# EAGLE design Keg Cop - Devel SMD (EAGLE 9.6.2)
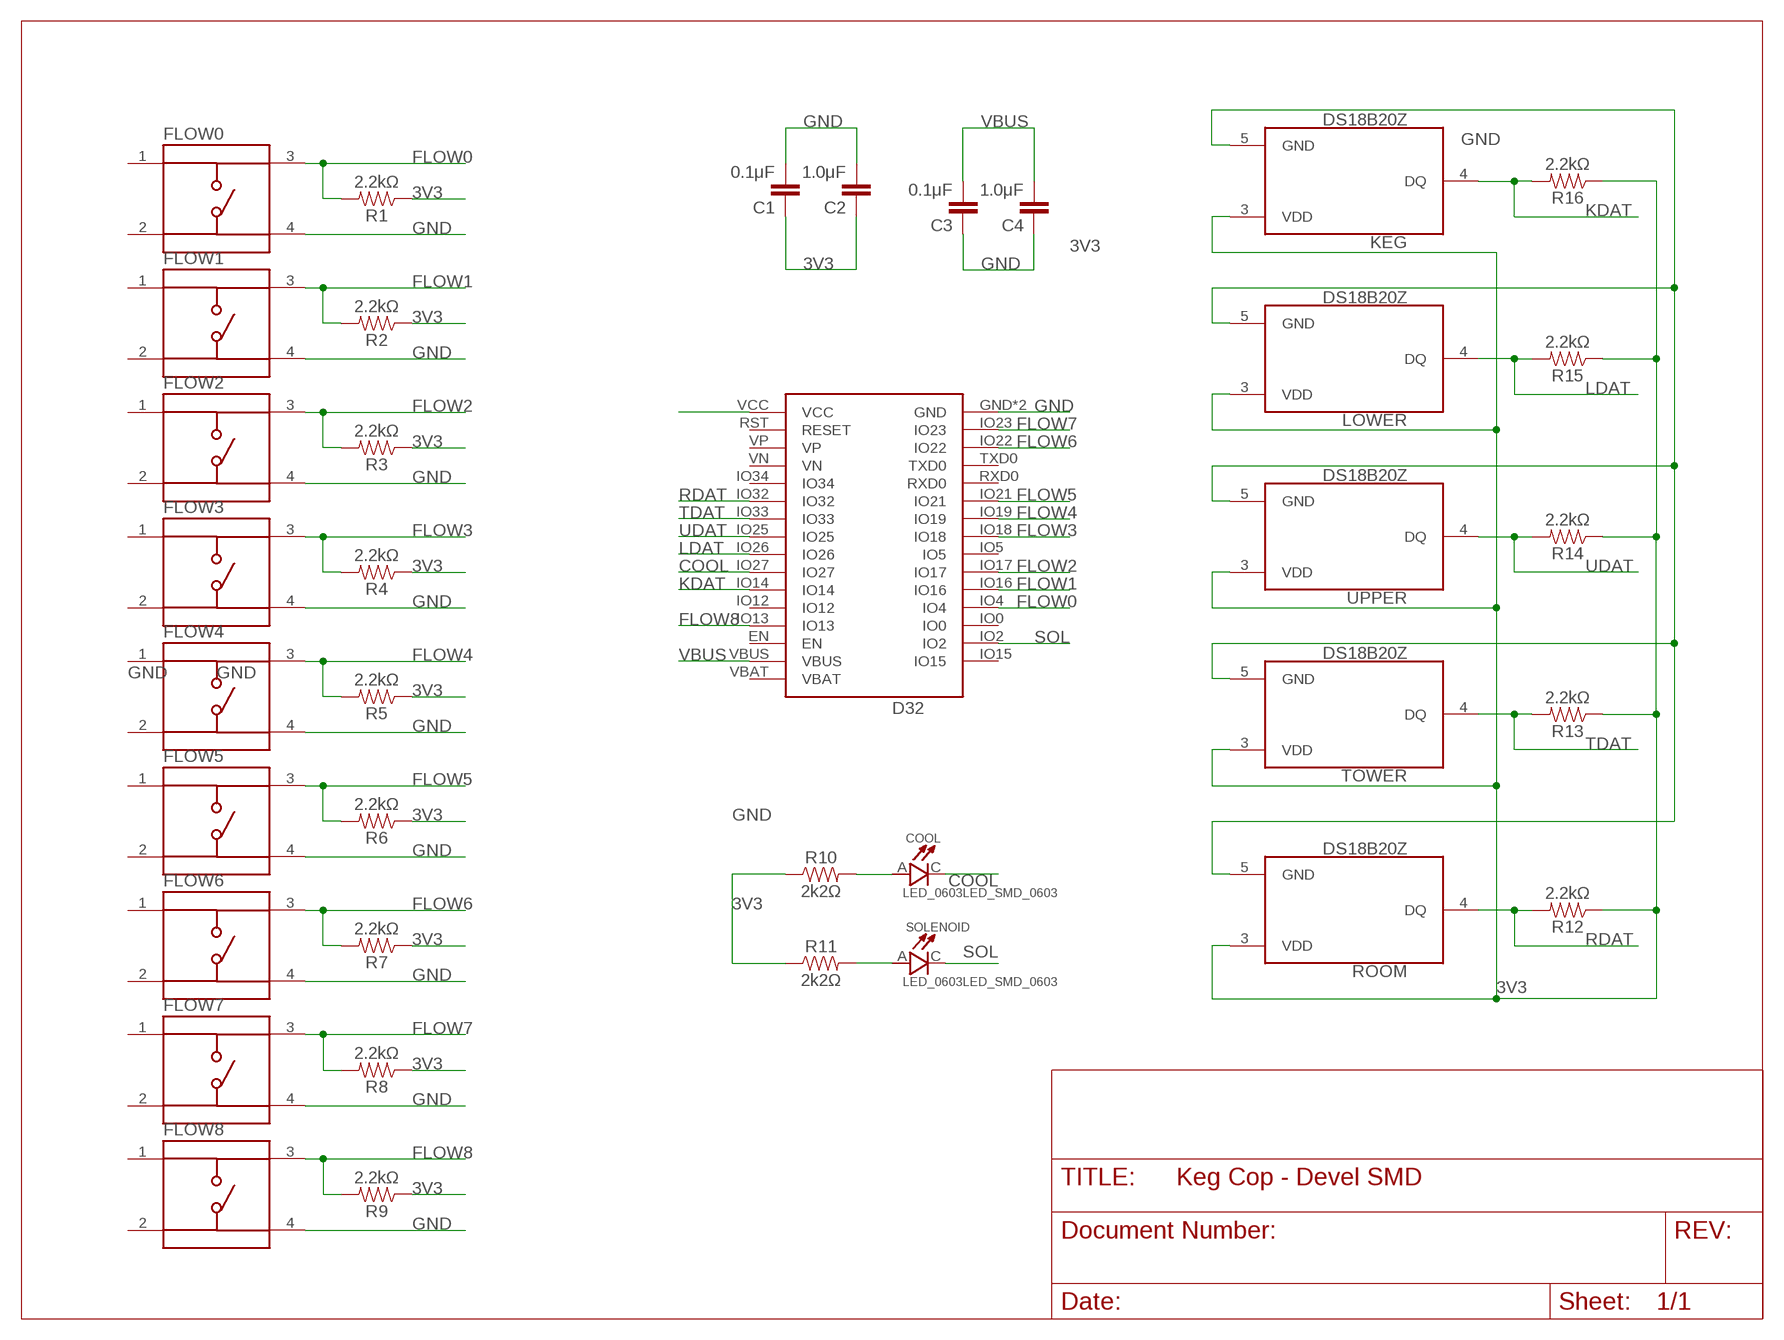
[diagram p0: schematic, sheet 1]

## Parts
C1  0.1μF  CAP_SMD0805  [SMD-0805]
C2  1.0μF  CAP_SMD0805  [SMD-0805]
C3  0.1μF  CAP_SMD0805  [SMD-0805]
C4  1.0μF  CAP_SMD0805  [SMD-0805]
COOL  LED_0603LED_SMD_0603  [LED_SMD_0603]
D32  Lolin D32  WEMOS-D32D32_NO_BATT  [D32_NO_BATT]
FLOW0  TS08-66-43-BK-160-SMT-67  [SW_TS08-66-43-BK-160-SMT-67]
FLOW1  TS08-66-43-BK-160-SMT-67  [SW_TS08-66-43-BK-160-SMT-67]
FLOW2  TS08-66-43-BK-160-SMT-67  [SW_TS08-66-43-BK-160-SMT-67]
FLOW3  TS08-66-43-BK-160-SMT-67  [SW_TS08-66-43-BK-160-SMT-67]
FLOW4  TS08-66-43-BK-160-SMT-67  [SW_TS08-66-43-BK-160-SMT-67]
FLOW5  TS08-66-43-BK-160-SMT-67  [SW_TS08-66-43-BK-160-SMT-67]
FLOW6  TS08-66-43-BK-160-SMT-67  [SW_TS08-66-43-BK-160-SMT-67]
FLOW7  TS08-66-43-BK-160-SMT-67  [SW_TS08-66-43-BK-160-SMT-67]
FLOW8  TS08-66-43-BK-160-SMT-67  [SW_TS08-66-43-BK-160-SMT-67]
KEG  DS18B20Z  [SOIC127P600X175-8N]
LOWER  DS18B20Z  [SOIC127P600X175-8N]
R1  2.2kΩ  RES_SMD0805  [SMD-0805]
R2  2.2kΩ  RES_SMD0805  [SMD-0805]
R3  2.2kΩ  RES_SMD0805  [SMD-0805]
R4  2.2kΩ  RES_SMD0805  [SMD-0805]
R5  2.2kΩ  RES_SMD0805  [SMD-0805]
R6  2.2kΩ  RES_SMD0805  [SMD-0805]
R7  2.2kΩ  RES_SMD0805  [SMD-0805]
R8  2.2kΩ  RES_SMD0805  [SMD-0805]
R9  2.2kΩ  RES_SMD0805  [SMD-0805]
R10  2k2Ω  RES_SMD0805  [SMD-0805]
R11  2k2Ω  RES_SMD0805  [SMD-0805]
R12  2.2kΩ  RES_SMD0805  [SMD-0805]
R13  2.2kΩ  RES_SMD0805  [SMD-0805]
R14  2.2kΩ  RES_SMD0805  [SMD-0805]
R15  2.2kΩ  RES_SMD0805  [SMD-0805]
R16  2.2kΩ  RES_SMD0805  [SMD-0805]
ROOM  DS18B20Z  [SOIC127P600X175-8N]
SOLENOID  LED_0603LED_SMD_0603  [LED_SMD_0603]
TOWER  DS18B20Z  [SOIC127P600X175-8N]
UPPER  DS18B20Z  [SOIC127P600X175-8N]

## Nets
3V3 [3v]: C1.1 C2.1 D32.VCC KEG.3(VDD) LOWER.3(VDD) R1.1 R2.1 R3.1 R4.1 R5.1 R6.1 R7.1 R8.1 R9.1 R10.1 R11.1 R12.1 R13.1 R14.1 R15.1 R16.1 ROOM.3(VDD) TOWER.3(VDD) UPPER.3(VDD)
COOL: COOL.C D32.IO27
FLOW0: D32.IO4 FLOW0.3 R1.2
FLOW1: D32.IO16 FLOW1.3 R2.2
FLOW2: D32.IO17 FLOW2.3 R3.2
FLOW3: D32.IO18 FLOW3.3 R4.2
FLOW4: D32.IO19 FLOW4.3 R5.2
FLOW5: D32.IO21 FLOW5.3 R6.2
FLOW6: D32.IO22 FLOW6.3 R7.2
FLOW7: D32.IO23 FLOW7.3 R8.2
FLOW8: D32.IO13 FLOW8.3 R9.2
GND: C1.2 C2.2 C3.1 C4.1 D32.GND D32.GND2(GND) FLOW0.4 FLOW1.4 FLOW2.4 FLOW3.4 FLOW4.4 FLOW5.4 FLOW6.4 FLOW7.4 FLOW8.4 KEG.5(GND) LOWER.5(GND) ROOM.5(GND) TOWER.5(GND) UPPER.5(GND)
KDAT: D32.IO14 KEG.4(DQ) R16.2
LDAT: D32.IO26 LOWER.4(DQ) R15.2
N$1: COOL.A R10.2
N$2: R11.2 SOLENOID.A
RDAT: D32.IO32 R12.2 ROOM.4(DQ)
SOL: D32.IO2 SOLENOID.C
TDAT: D32.IO33 R13.2 TOWER.4(DQ)
UDAT: D32.IO25 R14.2 UPPER.4(DQ)
VBUS: C3.2 C4.2 D32.VBUS
Unconnected: D32.EN D32.IO0 D32.IO5 D32.IO12 D32.IO15 D32.IO34 D32.RST(RESET) D32.RXD0 D32.TXD0 D32.VBAT D32.VN D32.VP FLOW0.1 FLOW0.2 FLOW1.1 FLOW1.2 FLOW2.1 FLOW2.2 FLOW3.1 FLOW3.2 FLOW4.1 FLOW4.2 FLOW5.1 FLOW5.2 FLOW6.1 FLOW6.2 FLOW7.1 FLOW7.2 FLOW8.1 FLOW8.2

## Library data of the parts
C1-C4 = JBJLC:CAP_SMD
COOL SOLENOID = JBJLC:LED_0603: RED CHIP LED MINI-MOLD Check availability <https://pricing.snapeda.com/parts/SML-D12U1WT86/Rohm/view-part?ref=eda>; DESCRIPTION: Red 620nm LED Indication - Discrete 2.2V 0603 (1608 Metric); LCSC_PART: C2286; PACKAGE: 0603 Rohm
D32 = Donnie:WEMOS-D32: D32_REVERSE is a Reverse silkscreen for placing the Wemos D32 on the underside of the board D32_NO-KEEPOUT removes the keepout area beneath the antenna on the D32 and provides a note to avoid components and traces.; SPICEPREFIX: X
FLOW0 FLOW1-FLOW8 = JBJLC:TS08-66-43-BK-160-SMT-67: Check availability <https://pricing.snapeda.com/parts/TS08-66-43-BK-160-SMT-67/CUI%20Devices/view-part?ref=eda>; DESCRIPTION: 6 x 6 mm, 4.3 mm Actuator Height, 160 gf, Black, Surface Mount, IP67, SPST, Tactile Switch; LCSC_PART: C2888744; MF: BZCN; MP: TSD003B04326A03
KEG LOWER ROOM TOWER UPPER = JBJLC:DS18B20Z: DALLAS - DALLAS DS18B20Z High-Precision 1-Wire Digital Thermometer Check availability <https://pricing.snapeda.com/parts/DS18B20Z/Maxim%20Integrated/view-part?ref=eda>; AVAILABILITY: In Stock; DESCRIPTION: Temperature Sensor Digital, Local -55°C ~ 125°C 12 b 8-SOIC; LCSC_PART: C695837; MF: Maxim Integrated; MP: DS18B20Z; PACKAGE: SOIC-8 Maxim; PRICE: None; PURCHASE-URL: https://pricing.snapeda.com/search/part/DS18B20Z/?ref=eda
R1-R16 = JBJLC:RES_SMD

## Net classes
0 default: width 0.305 mm, clearance 0.305 mm
1 5v: width 0.406 mm, clearance 0.406 mm
2 3v: width 0.406 mm, clearance 0.406 mm

## Board
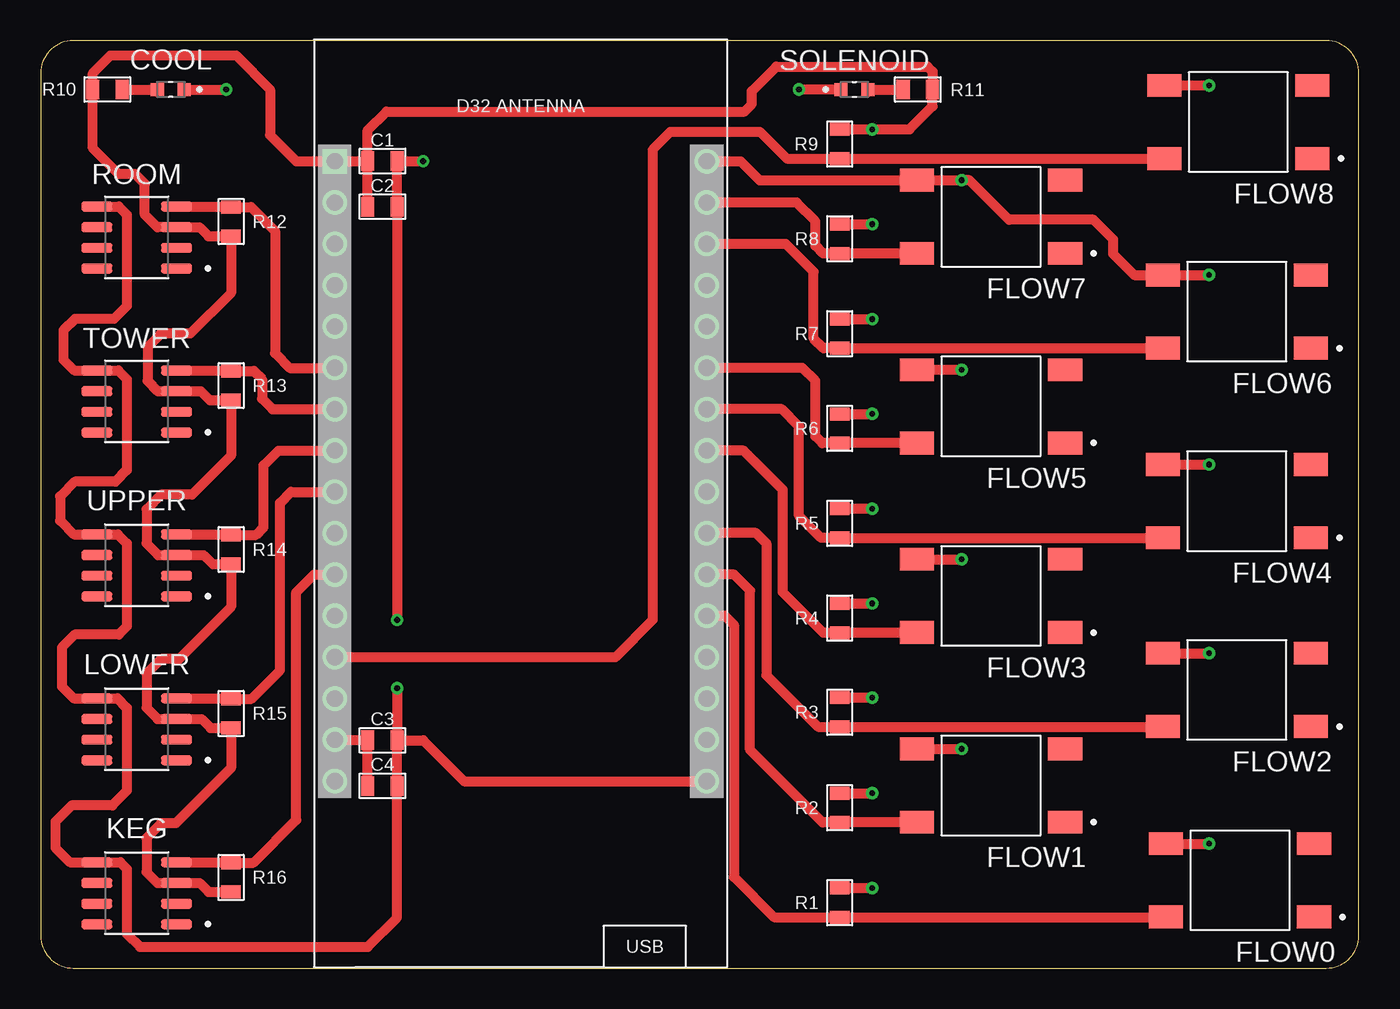
[diagram p1: board, top side]
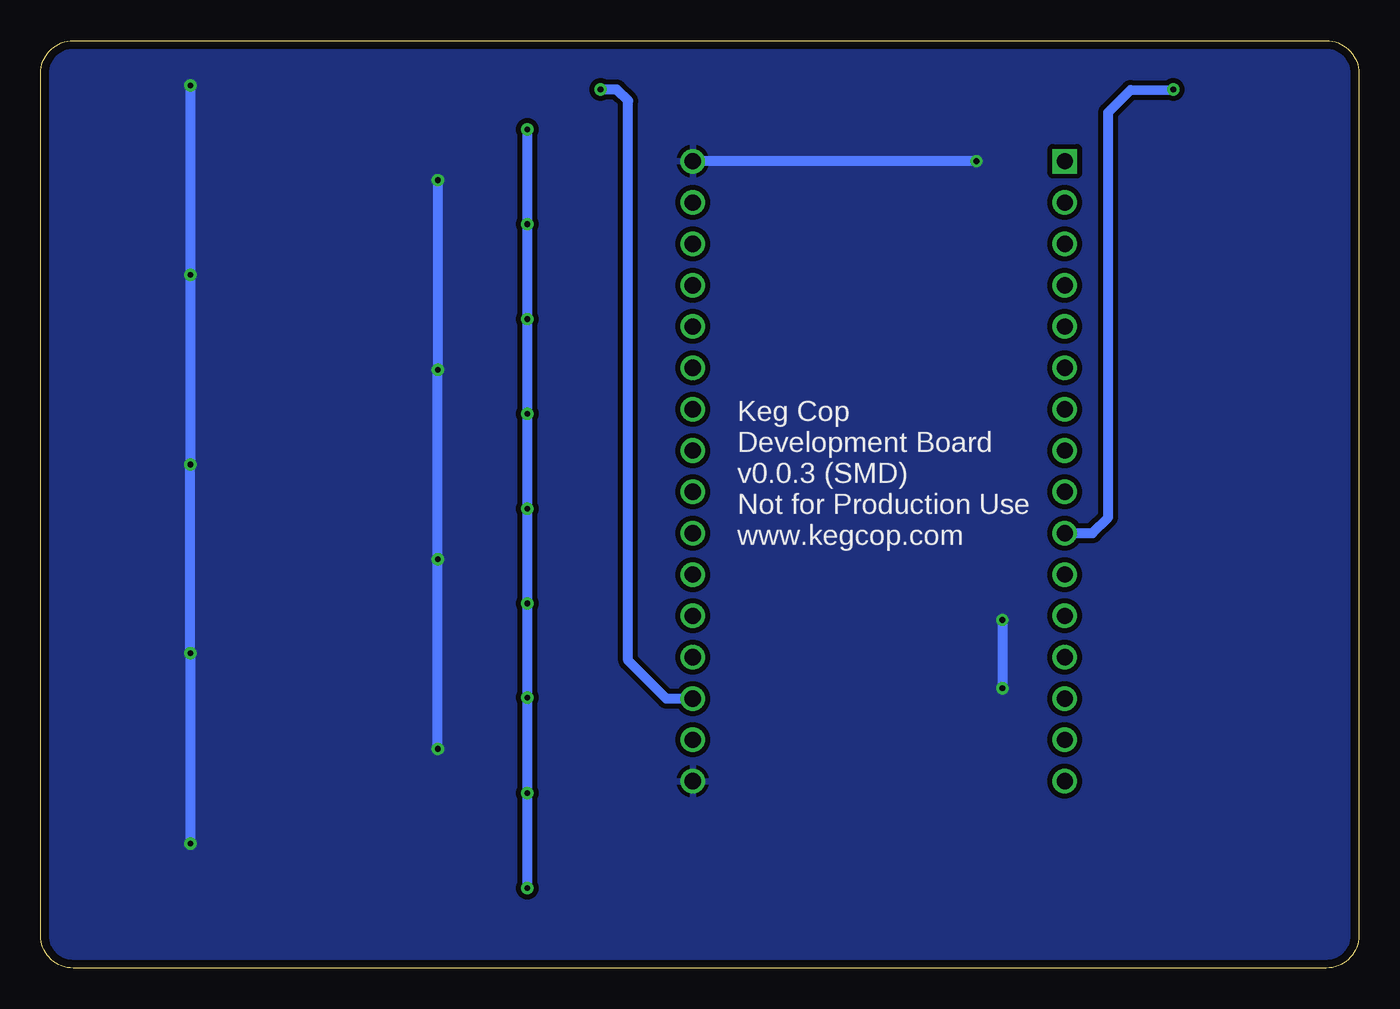
[diagram p2: board, bottom side, seen from below]

Size 81 x 57 mm. Coordinates in mm from the lower left corner, seen from the top.
Outline: 0,55 0,2 arc90 2,0 79,0 arc90 81,2 81,55 arc90 79,57 2,57 arc90 0,55
Copper layers (1*16): Top 0.035mm / dielectric 1.5mm / Bottom 0.035mm
Design rules "default *": minimum track width 6mil, minimum drill 0.35mm, track to track 6mil, track to pad 6mil, pad to pad 6mil, via to via 6mil, smd to smd 6mil, copper to edge 20mil, drill to drill 6mil, minimum pad ring 10mil, minimum via ring 8mil, stop-mask expansion 4mil, vias tented up to drill 20mil, thermal gap 10mil

### Footprints (pad centres in the part's own frame; a part is rotated, then mirrored left to right if it is on the bottom)
SMD-0805 = smd 0.8 x 1.2: 1 -0.9,0; 2 0.9,0
LED_SMD_0603 = smd 0.8 x 0.8: A 0.825,0; C -0.825,0
D32_NO_BATT = drill 1: EN -11.43,-12.7; GND 11.43,20.32; GND2 11.43,-17.78; IO0 11.43,-10.16; IO2 11.43,-12.7; IO4 11.43,-7.62; IO5 11.43,0; IO12 -11.43,-7.62; IO13 -11.43,-10.16; IO14 -11.43,-5.08; IO15 11.43,-15.24; IO16 11.43,-5.08; IO17 11.43,-2.54; IO18 11.43,2.54; IO19 11.43,5.08; IO21 11.43,7.62; IO22 11.43,15.24; IO23 11.43,17.78; IO25 -11.43,2.54; IO26 -11.43,0; IO27 -11.43,-2.54; IO32 -11.43,7.62; IO33 -11.43,5.08; IO34 -11.43,10.16; RST -11.43,17.78; RXD0 11.43,10.16; TXD0 11.43,12.7; VBAT -11.43,-17.78; VBUS -11.43,-15.24; VN -11.43,12.7; VP -11.43,15.24 | drill 1 square: VCC -11.43,20.32
SW_TS08-66-43-BK-160-SMT-67 = smd 2.1 x 1.4: 1 -4.55,2.25; 2 -4.55,-2.25; 3 4.55,2.25; 4 4.55,-2.25
SOIC127P600X175-8N = smd 1.9 x 0.6: 1 -2.455,1.905; 2 -2.455,0.635; 3 -2.455,-0.635; 4 -2.455,-1.905; 5 2.455,-1.905; 6 2.455,-0.635; 7 2.455,0.635; 8 2.455,1.905

### Placement (x,y rotation side)
C1  21,49.6 0 top
C2  21,46.8 0 top
C3  21,14 180 top
C4  21,11.2 180 top
COOL  8,54 180 top
D32  29.5,29.27 0 top
FLOW0  73.7,5.4 180 top
FLOW1  58.4,11.22 180 top
FLOW2  73.5,17.1 180 top
FLOW3  58.4,22.88 180 top
FLOW4  73.5,28.7 180 top
FLOW5  58.4,34.52 180 top
FLOW6  73.5,40.35 180 top
FLOW7  58.4,46.17 180 top
FLOW8  73.6,52 180 top
KEG  5.9,4.6 180 top
LOWER  5.9,14.68 180 top
R1  49.1,4.03 270 top
R2  49.1,9.85 270 top
R3  49.1,15.73 270 top
R4  49.1,21.51 270 top
R5  49.1,27.34 270 top
R6  49.1,33.17 270 top
R7  49.1,38.99 270 top
R8  49.1,44.82 270 top
R9  49.1,50.65 270 top
R10  4.1,54 0 top
R11  53.9,54 180 top
R12  11.7,45.88 90 top
R13  11.7,35.8 90 top
R14  11.7,25.73 90 top
R15  11.7,15.65 90 top
R16  11.7,5.58 90 top
ROOM  5.9,44.9 180 top
SOLENOID  50,54 0 top
TOWER  5.9,34.83 180 top
UPPER  5.9,24.75 180 top

### Tracks (layer width: path | path; a pad name or v marks a point on that pad's centre or on a via)
3V3  (via drill 0.35)
  Top 0.61: R16.1 10.32,4.68 9.77,5.24 KEG.3 7.17,5.24 6.5,5.9 6.5,8 7.4,8.9 8.3,8.9 11.7,12.3 R15.1 10.45,14.75 9.89,15.31 LOWER.3 7.19,15.31 6.5,16 6.5,18.1 7.4,19 8.5,19 11.7,22.2 R14.1 10.57,24.83 10.02,25.39 UPPER.3 7.21,25.39 6.5,26.1 6.5,28.2 7.4,29.1 9.3,29.1 11.7,31.5 R13.1 10.4,34.9 9.84,35.46 TOWER.3 7.2,35.46 6.56,36.1 6.56,38.16 7.4,39 9.2,39 11.7,41.5 R12.1 10.32,44.98 9.77,45.53 ROOM.3 7.17,45.53 6.4,46.3 6.4,48.2 5.8,48.8 4.8,48.8 3.2,50.4 R10.1 3.2,55 4.3,56.1 12,56.1 14.1,54 14.1,51.2 15.71,49.59 D32.VCC 20.09,49.59 | 20.09,49.59 C1.1 20.1,51.5 21.25,52.65 43.25,52.65 43.7,53.1 43.7,53.9 45.2,55.4 54.5,55.4 54.8,55.1 R11.1 54.8,52.96 53.39,51.55 v51.1,51.55 R9.1 | C2.1 20.1,49.58 20.09,49.59 | R3.1 v51.1,16.63 | R4.1 v51.1,22.41 | R5.1 v51.1,28.24 | R7.1 v51.1,39.89 | R2.1 v51.1,10.75 | R1.1 v51.1,4.92 | R8.1 v51.1,45.72 | R6.1 v51.1,34.07
  Bottom 0.61: v51.1,51.55 v51.1,45.72 v51.1,39.89 v51.1,34.07 v51.1,28.24 v51.1,22.41 v51.1,16.63 v51.1,10.75 v51.1,4.92
COOL  (via drill 0.35)
  Top 0.61: COOL.C v11.4,54
  Bottom 0.61: D32.IO27 16.37,26.73 15.4,27.7 15.4,52.6 14.04,53.96 v11.4,54
FLOW0
  Top 0.61: FLOW0.3 69.12,3.12 R1.2 45.08,3.12 42.6,5.6 42.6,21.1 42.05,21.65 D32.IO4
FLOW1
  Top 0.61: D32.IO16 42.61,24.19 43.6,23.2 43.6,13.4 48.05,8.95 R2.2 49.12,8.97 FLOW1.3
FLOW2
  Top 0.61: FLOW2.3 68.93,14.78 68.88,14.83 R3.2 47.77,14.83 44.6,18 44.6,26.1 43.97,26.73 D32.IO17
FLOW3
  Top 0.61: FLOW3.3 53.83,20.61 R4.2 48.09,20.61 45.6,23.1 45.6,29.4 43.19,31.81 D32.IO18
FLOW4
  Top 0.61: FLOW4.3 68.94,26.44 R5.2 47.96,26.44 46.6,27.8 46.6,33.3 45.55,34.35 D32.IO19
FLOW5
  Top 0.61: FLOW5.3 R6.2 48.03,32.27 47.6,32.7 47.6,36.1 46.81,36.89 D32.IO21
FLOW6
  Top 0.61: FLOW6.3 R7.2 48.11,38.09 47.5,38.7 47.5,42.8 45.79,44.51 D32.IO22
FLOW7
  Top 0.61: FLOW7.3 R8.2 48.08,43.92 47.6,44.4 47.6,45.9 46.45,47.05 D32.IO23
FLOW8
  Top 0.61: FLOW8.3 R9.2 45.85,49.75 45.6,50 44.2,51.4 38.7,51.4 37.6,50.3 37.6,21.4 35.31,19.11 D32.IO13
GND  (via drill 0.35)
  Top 0.61: ROOM.5 4.79,46.8 5.3,46.3 5.3,40.7 4.5,39.9 2.1,39.9 1.4,39.2 1.4,37.4 2.07,36.73 TOWER.5 4.77,36.73 5.3,36.2 5.3,30.6 4.6,29.9 2.1,29.9 1.2,29 1.2,27.5 2.04,26.66 UPPER.5 4.75,26.66 5.3,26.1 5.3,21 4.8,20.5 2.1,20.5 1.3,19.7 1.3,17.3 2.02,16.58 LOWER.5 4.72,16.58 5.3,16 5.3,10.9 4.4,10 1.9,10 0.9,9 0.9,7.4 1.79,6.5 KEG.5 4.89,6.5 5.3,6.1 5.3,2.1 6.1,1.3 20.1,1.3 21.9,3.1 C4.1 C3.1 | C3.1 23.5,14 26.01,11.49 D32.GND2 | v23.5,49.6 C1.2 C2.2 v21.9,21.4 | D32.GND 43.01,49.59 44.17,48.42 FLOW7.4 v56.6,48.42 57.08,48.42 59.5,46 64.7,46 65.9,44.8 65.9,43.9 67.2,42.6 FLOW6.4 v71.8,42.6 | FLOW1.4 v56.6,13.47 | FLOW3.4 v56.6,25.12 | FLOW5.4 v56.6,36.77 | FLOW0.4 v71.8,7.65 | FLOW2.4 v71.8,19.35 | FLOW4.4 v71.8,30.95 | FLOW8.4 v71.8,54.25 | v21.9,17.2 C3.1
  Bottom 0.61: v23.5,49.6 D32.GND | v56.6,48.42 v56.6,36.77 v56.6,25.12 v56.6,13.47 | v71.8,54.25 v71.8,42.6 v71.8,30.95 v71.8,19.35 v71.8,7.65 | v21.9,21.4 v21.9,17.2
  pour Bottom (isolate 0.305): 0.1,0 0.1,56.8 80.9,56.8 80.9,0.48 arc45 81.1,0 0.34,0 arc45 0.1,-0.1
KDAT
  Top 0.61: KEG.4 11.67,6.5 R16.2 13.08,6.48 15.7,9.1 15.7,23.1 16.79,24.19 D32.IO14
LDAT
  Top 0.61: LOWER.4 11.67,16.58 R15.2 12.95,16.55 14.7,18.3 14.7,28.6 15.37,29.27 D32.IO26
N$1
  Top 0.61: R10.2 COOL.A
N$2
  Top 0.61: SOLENOID.A R11.2
RDAT
  Top 0.61: ROOM.4 11.67,46.8 R12.2 12.92,46.78 14.4,45.3 14.4,37.8 15.31,36.89 D32.IO32
SOL  (via drill 0.35)
  Top 0.61: SOLENOID.C v46.6,54
  Bottom 0.61: D32.IO2 42.57,16.57 44.9,18.9 44.9,53.3 45.6,54 v46.6,54
TDAT
  Top 0.61: TOWER.4 11.67,36.73 R13.2 13.1,36.7 13.6,36.2 13.6,35 14.25,34.35 D32.IO33
UDAT
  Top 0.61: UPPER.4 11.67,26.66 R14.2 13.23,26.63 13.7,27.1 13.7,30.9 14.61,31.81 D32.IO25
VBUS
  Top 0.61: D32.VBUS 20.07,14.03 C3.2 C4.2

### Text on the board
bNames: Keg Cop / Development Board / v0.0.3 (SMD) / Not for Production Use / www.kegcop.com